# EasyEDA schematic EasyEDA Schematic_Split Flap Controller Board 12-1-23.json
TITLE: Split Flap Controller Board; REV: 1.0; Date: 2023-08-08; Sheet: 1/1; Drawn By: jpwolfe31; Company: John Wolfe
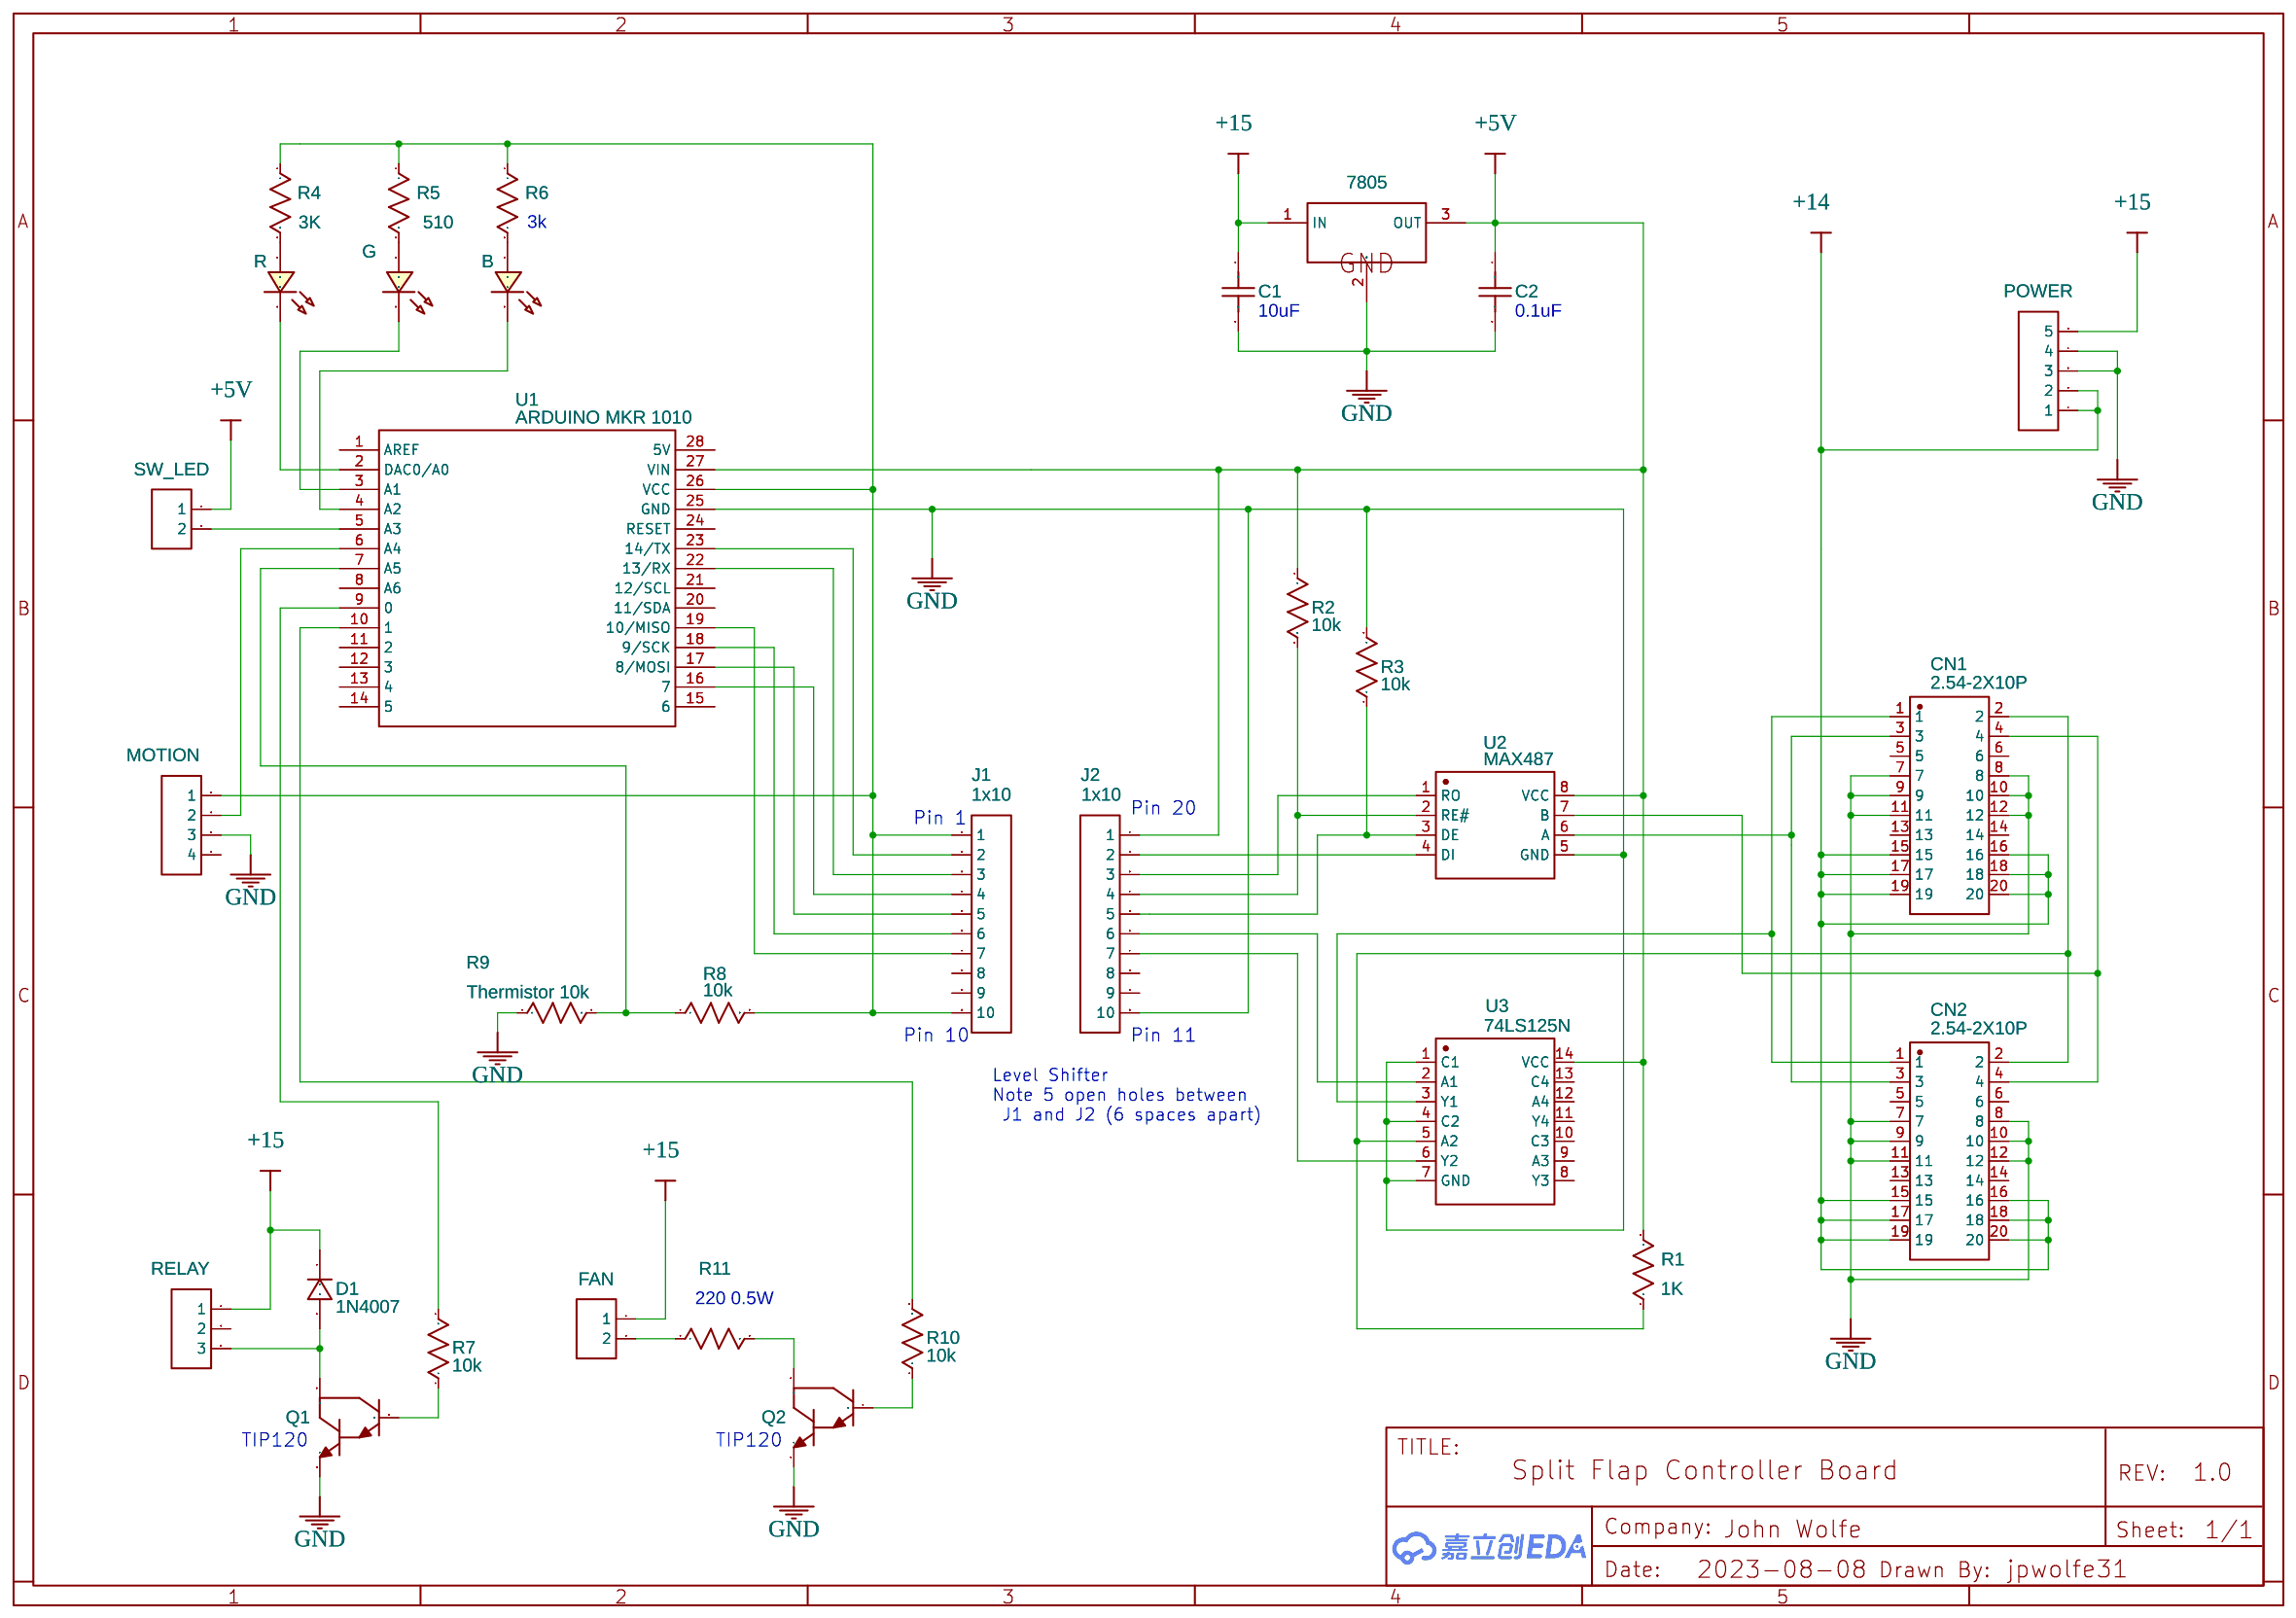
[diagram p0: schematic sheet]

## Parts
1K  R1  [R_AXIAL-0.3]
3K  R5  [R_AXIAL-0.3]
510  R4  [R_AXIAL-0.3]
7805  7805  [TO-220-3_L10.0-W4.5-P2.54-L]
B  LED-TH-3mm_B  [LED-TH_BD3.0_BLUE]
C1  1u  [RAD-0.1]
C2  1u  [RAD-0.1]
CN1  2.54-2X10P  [CONN-TH_20P-P2.54_KINGHELM_KH-DC3-2.54-2X10P]
CN2  2.54-2X10P  [CONN-TH_20P-P2.54_KINGHELM_KH-DC3-2.54-2X10P]
D1  1N4007  [DO-35_BD2.0-L4.2-P8.20-D0.5-RD]
FAN  HDR-M-2.54_1x2  [HDR-M-2.54_1X2]
G  LED-TH-3mm_G  [LED-TH_BD3.0_GREEN]
J1  1x10  [HDR-TH_10P-P2.54-V-F]
J2  1x10  [HDR-TH_10P-P2.54-V-F]
MOTION  HDR-M-2.54_1x4  [HDR-M-2.54_1X4]
POWER  CN3  [HDR-F-2.54_1X5]
Q1  Q1  [TO-220-3_L10.0-W4.5-P2.54-T]
Q2  TIP120  [TO-220-3_L10.0-W4.5-P2.54-T]
R  LED-TH-3mm_R  [LED-TH_BD3.0_RED]
R2  10k  [R_AXIAL-0.3]
R3  10k  [R_AXIAL-0.3]
R6  R6  [R_AXIAL-0.3]
R7  10k  [R_AXIAL-0.3]
R8  10k  [R_AXIAL-0.3]
R9  Thermistor 10k  [R_AXIAL-0.3]
R10  10k  [R_AXIAL-0.3]
R11  R11  [R_AXIAL-0.4]
RELAY  HDR-M-2.54_1x3  [HDR-M-2.54_1X3]
SW_LED  HDR-M-2.54_1x2  [HDR-M-2.54_1X2]
U1  ARDUINO MKR 1010  [ARDUINOMKR1010]
U2  MAX487  [DIP-8_L9.8-W6.6-P2.54-LS7.6-BL]
U3  74LS125N  [74LS125]

## Library data of the parts
1K 3K 510 R2 R3 R6-R10 = R_AXIAL-0.3_US: Contributor: LCEDA_Lib
7805 = 7805(TO-220): Supplier: LCSC; Manufacturer: STMicroelectronics; Manufacturer Part: L7805CV-DG; Supplier Part: C3795; Contributor: LCEDA_Lib
B = LED-TH-3mm_B: Manufacturer: EVERLIGHT(台湾亿光); Manufacturer Part: 204-10SUBC/S400-A4; Supplier Part: C86881; Supplier: LCSC; Contributor: LCEDA_Lib
C1 C2 = C_RAD-0.1_US: Contributor: LCEDA_Lib
CN1 CN2 = KH-DC3-2.54-2X10P: Supplier: LCSC; Supplier Part: C5157633; Manufacturer: kinghelm(金航标); link: https://atta.szlcsc.com/upload/public/pdf/source/20220902/CF025B83B1EC9998494A23D3080F236C.pdf; Contributor: lcsc; JLCPCB Part Class: Extended Part
D1 = 1N4148: Supplier: LCSC; Supplier Part: C13769; Manufacturer: STMicroelectronics; Contributor: LCSC
FAN SW_LED = HDR-M-2.54_1x2: Supplier Part: C124375; Supplier: LCSC; Contributor: LCEDA_Lib
G = LED-TH-3mm_G: Manufacturer: EVERLIGHT(台湾亿光); Manufacturer Part: 204-10SYGD/S530-E3; Supplier Part: C85161; Contributor: LCEDA_Lib
J1 J2 = Header-Female-2.54_1x10: Supplier: LCSC; Manufacturer: BOOMELE(博穆精密); Supplier Part: C35445; JLCPCB Part Class: Extended Part
MOTION = HDR-M-2.54_1x4: Supplier Part: C124378; Supplier: LCSC; Contributor: LCEDA_Lib
POWER = HDR-F-2.54_1x5: Supplier Part: C50950; Supplier: LCSC; Contributor: LCEDA_Lib
Q1 Q2 = TIP122_C84073: Supplier: LCSC; Manufacturer: CJ(江苏长电/长晶); Supplier Part: C84073; JLCPCB Part Class: Extended Part
R = LED-TH-3mm_R: Manufacturer: EVERLIGHT(台湾亿光); Manufacturer Part: 204-10SDRD/S530-A3-L; Supplier Part: C84774; Supplier: LCSC; Contributor: LCEDA_Lib
R11 = R_AXIAL-0.4_US: Contributor: LCEDA_Lib
RELAY = HDR-M-2.54_1x3: Supplier Part: C180248; Supplier: LCSC; Contributor: LCEDA_Lib
U1 = ARDUINO MKR 1010: Contributor: daniel.a.castro.pasos
U2 = MAX487CPA: Supplier: LCSC; Manufacturer: MAXIM; Supplier Part: C9952; JLCPCB Part Class: Extended Part
U3 = 74LS125N: Quad bus BUFFER, 3-state; subpart_no: 1; Contributor: TomPilot

## Nets
+5V: 1K.2 7805.3(OUT) C2.1 J2.1 R2.1 SW_LED.1 U1.27(VIN) U2.8(VCC) U3.14(VCC)
GND: 7805.2(GND) C1.2 C2.2 CN1.7 CN1.8 CN1.9 CN1.10 CN1.11 CN1.12 CN2.7 CN2.8 CN2.9 CN2.10 CN2.11 CN2.12 J2.10 MOTION.3 POWER.3 POWER.4 Q1.3(E) Q2.3(E) R3.2 R9.1 U1.25(GND) U2.5(GND) U3.1(C1) U3.4(C2) U3.7(GND)
+14: CN1.15 CN1.16 CN1.17 CN1.18 CN1.19 CN1.20 CN2.15 CN2.16 CN2.17 CN2.18 CN2.19 CN2.20 POWER.1 POWER.2
+15: 7805.1(IN) C1.1 D1.1 FAN.1 POWER.5 RELAY.1
Net-(1K-1): 1K.1 CN1.2 CN2.2 U3.5(A2)
Net-(3K-1): 3K.1 510.1 J1.1 J1.10 MOTION.1 R6.1 R8.2 U1.26(VCC)
Net-(3K-2): 3K.2 G.1
Net-(510-2): 510.2 R.1
Net-(B-1): B.1 R6.2
Net-(B-2): B.2 U1.4(A2)
Net-(CN1-1): CN1.1 CN2.1 U3.3(Y1)
Net-(CN1-3): CN1.3 CN2.3 U2.6(A)
Net-(CN1-4): CN1.4 CN2.4 U2.7(B)
Net-(D1-2): D1.2 Q1.2(C) RELAY.3
Net-(FAN-2): FAN.2 R11.1
Net-(G-2): G.2 U1.3(A1)
Net-(J1-2): J1.2 U1.23(14/TX)
Net-(J1-3): J1.3 U1.22(13/RX)
Net-(J1-4): J1.4 U1.16(7)
Net-(J1-5): J1.5 U1.17(8/MOSI)
Net-(J1-6): J1.6 U1.18(9/SCK)
Net-(J1-7): J1.7 U1.19(10/MISO)
Net-(J2-2): J2.2 U2.4(DI)
Net-(J2-3): J2.3 U2.1(RO)
Net-(J2-4): J2.4 R2.2 U2.2(RE#)
Net-(J2-5): J2.5 R3.1 U2.3(DE)
Net-(J2-6): J2.6 U3.2(A1)
Net-(J2-7): J2.7 U3.6(Y2)
Net-(MOTION-2): MOTION.2 U1.6(A4)
Net-(Q1-1): Q1.1(B) R7.1
Net-(Q2-1): Q2.1(B) R10.1
Net-(Q2-2): Q2.2(C) R11.2
Net-(R7-2): R7.2 U1.9(0)
Net-(R8-1): R8.1 R9.2 U1.7(A5)
Net-(R10-2): R10.2 U1.10(1)
Net-(R-2): R.2 U1.2(DAC0/A0)
Net-(SW_LED-2): SW_LED.2 U1.5(A3)

Not connected (* = marked no-connect by the designer): CN1 5 6 13 14; CN2 5 6 13 14; J1 8 9; J2 8 9; MOTION 4; RELAY 2; U1 1(AREF) 8(A6) 11(2) 12(3) 13(4) 14(5) 15(6) 20(11/SDA) 21(12/SCL) 24(RESET) 28(5V); U3 8(Y3) 9(A3) 10(C3) 11(Y4) 12(A4) 13(C4)

## Notes on the sheet
- 3k
- 10uF
- 0.1uF
- Pin 1
- Pin 20
- Pin 10
- Pin 11
- Level Shifter
- Note 5 open holes between
- J1 and J2 (6 spaces apart)
- 220 0.5W
- TIP120
- TIP120
